# EAGLE design e1-xover (EAGLE 7.7.0)
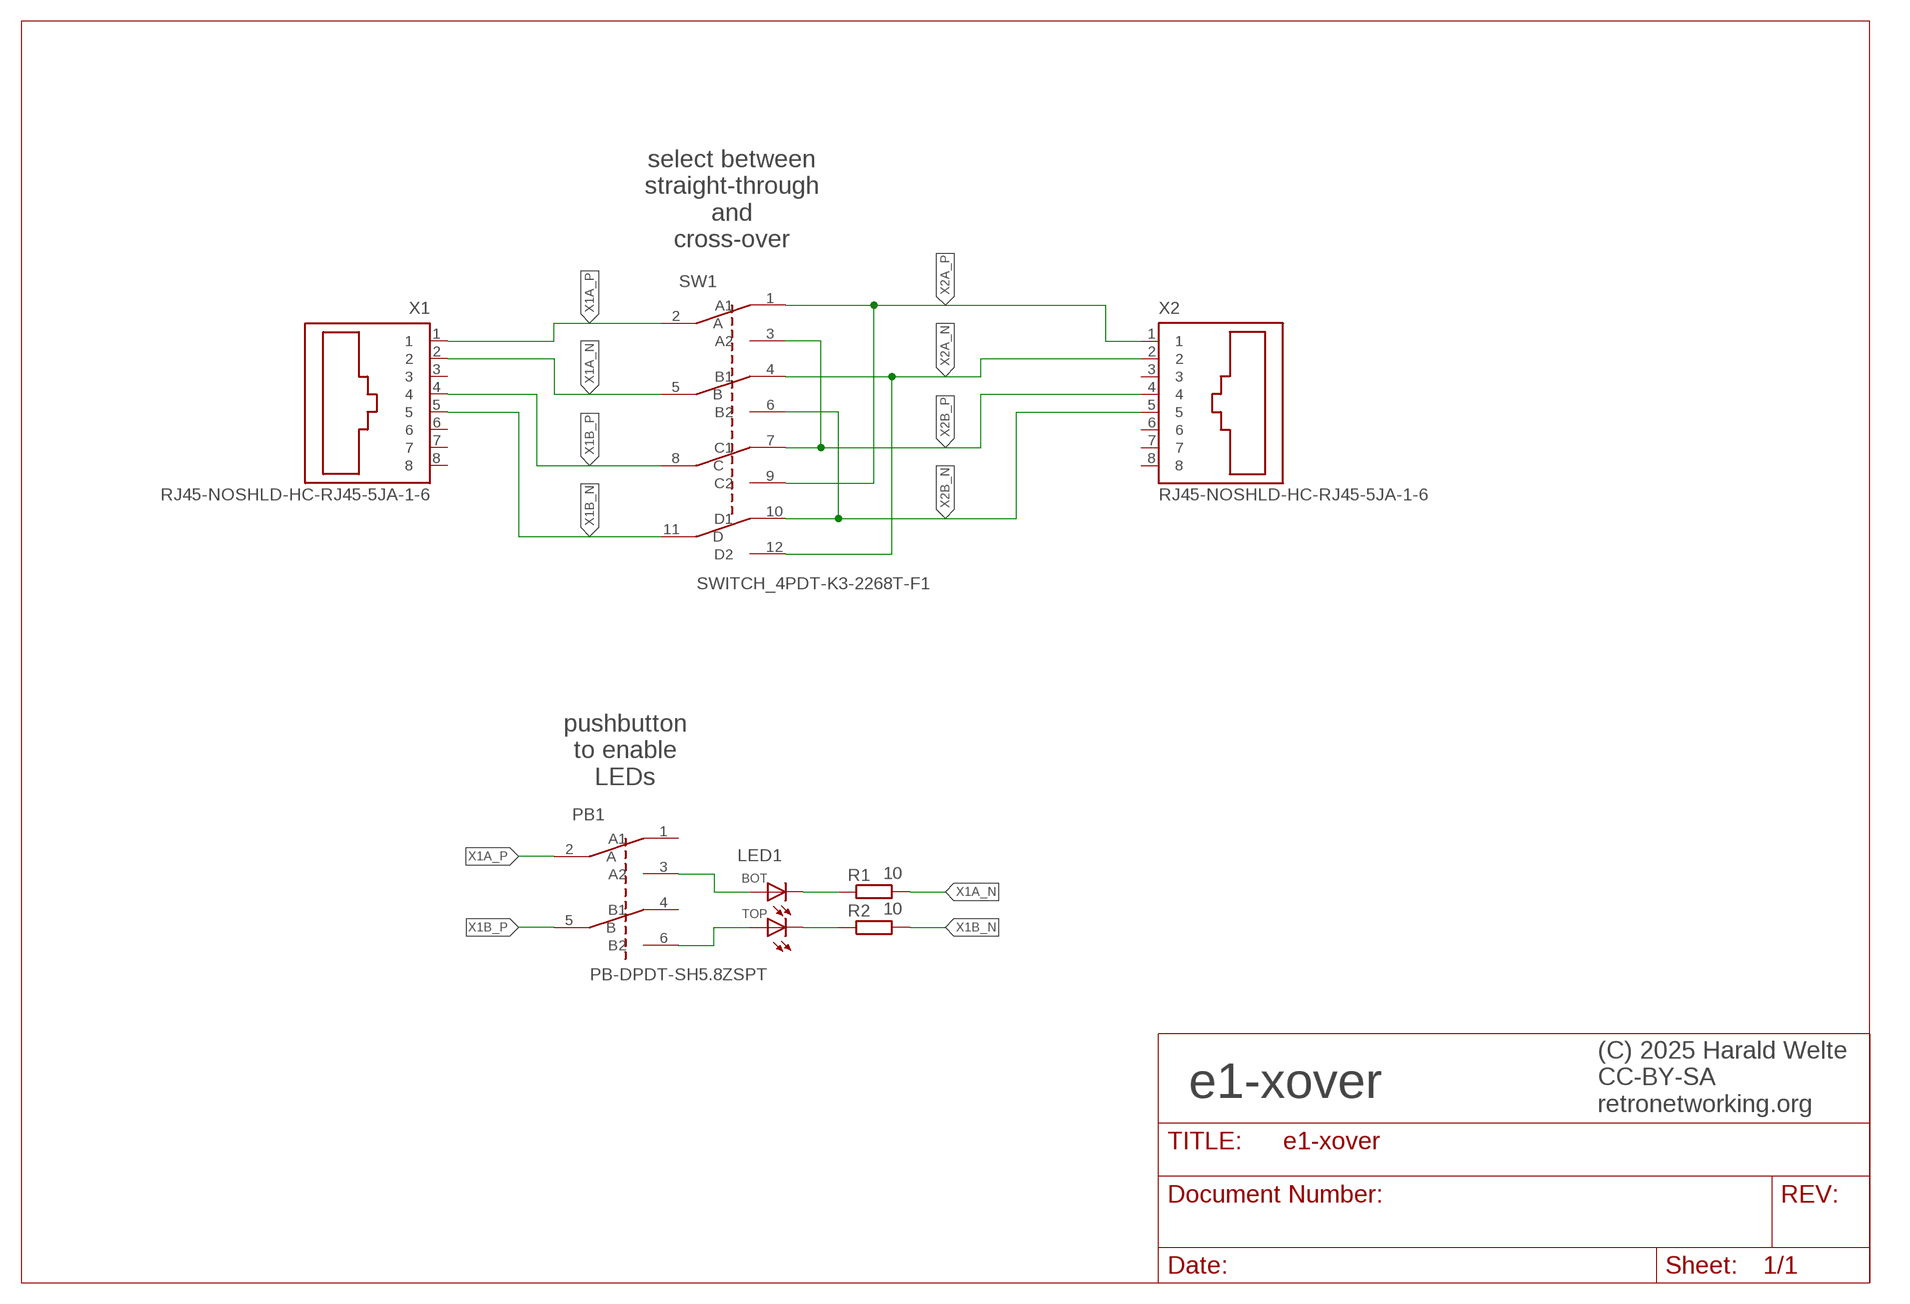
[diagram p0: schematic, sheet 1]

## Parts
LED1  DIALIGHT_2V-MHK2512RGTD  [MHK2512RGTD]
PB1  PB-DPDT-SH5.8ZSPT  [SH-5.8ZSPT]
R1  10  R-EU_0207/7  [0207/7]
R2  10  R-EU_0207/7  [0207/7]
SW1  SWITCH_4PDT-K3-2268T-F1  [K3--2268T-F1]
X1  RJ45-NOSHLD-HC-RJ45-5JA-1-6  [HC-RJ45-5JA-1-6]
X2  RJ45-NOSHLD-HC-RJ45-5JA-1-6  [HC-RJ45-5JA-1-6]

## Nets
N$3: LED1.BK(CB) R1.1
N$4: LED1.AK(CT) R2.1
N$9: LED1.BA(AB) PB1.3(A2)
N$10: LED1.AA(AT) PB1.6(B2)
X1A_N: R1.2 SW1.5(B) X1.2
X1A_P: PB1.2(A) SW1.2(A) X1.1
X1B_N: R2.2 SW1.11(D) X1.5
X1B_P: PB1.5(B) SW1.8(C) X1.4
X2A_N: SW1.4(B1) SW1.12(D2) X2.2
X2A_P: SW1.1(A1) SW1.9(C2) X2.1
X2B_N: SW1.6(B2) SW1.10(D1) X2.5
X2B_P: SW1.3(A2) SW1.7(C1) X2.4
Unconnected: PB1.1(A1) PB1.4(B1) X1.3 X1.6 X1.7 X1.8 X2.3 X2.6 X2.7 X2.8

## Notes on the sheet
- select between
  straight-through
  and
  cross-over
- pushbutton
  to enable
  LEDs
- e1-xover
- (C) 2025 Harald Welte
  CC-BY-SA
  retronetworking.org

## Library data of the parts
LED1 = led-dialight:DIALIGHT_2V: Dialight LED assembly, 2 leds, 3mm, vertical, through-hole, right-angle
PB1 = laforge:PB-DPDT: dual-pole dual-throw push-button
R1 R2 = resistor:R-EU_: RESISTOR, European symbol
SW1 = laforge:SWITCH_4PDT
X1 X2 = stewart-rj45:RJ45-NOSHLD

## Board
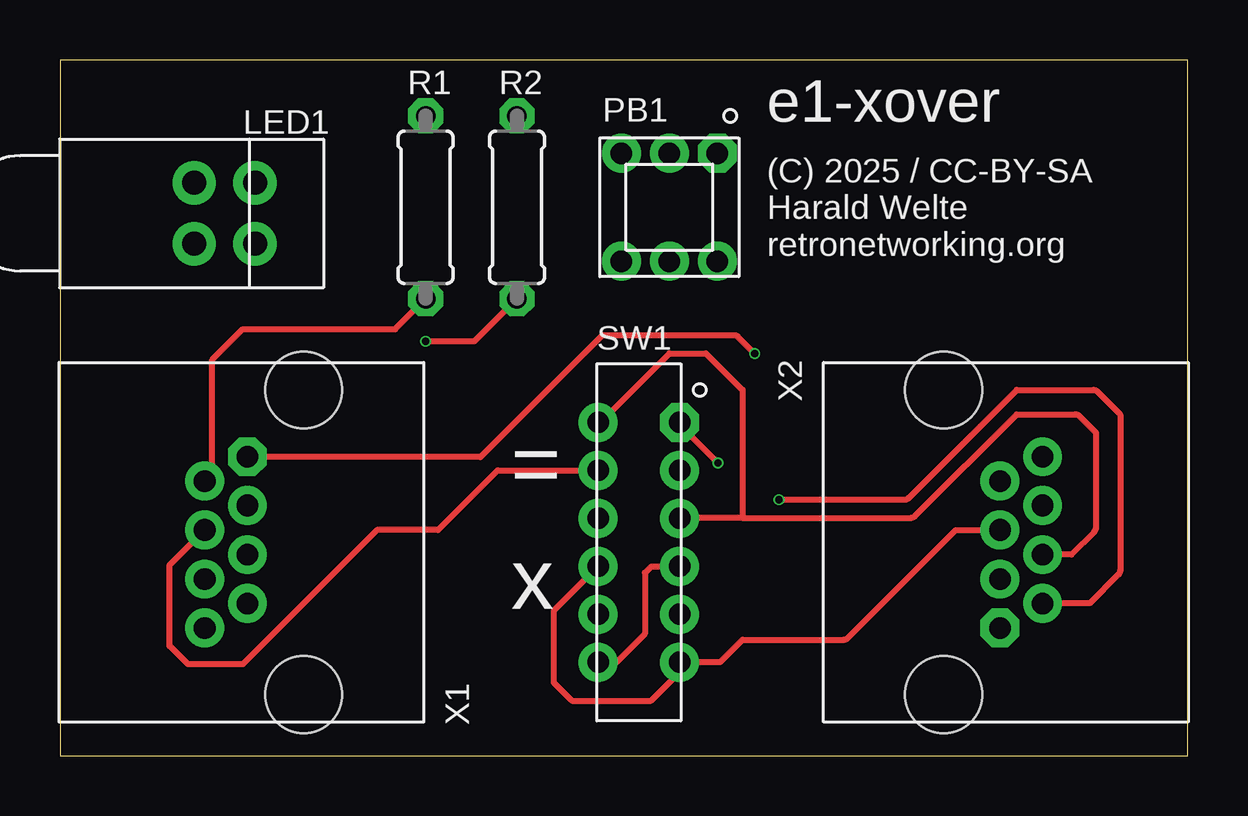
[diagram p1: board, top side]
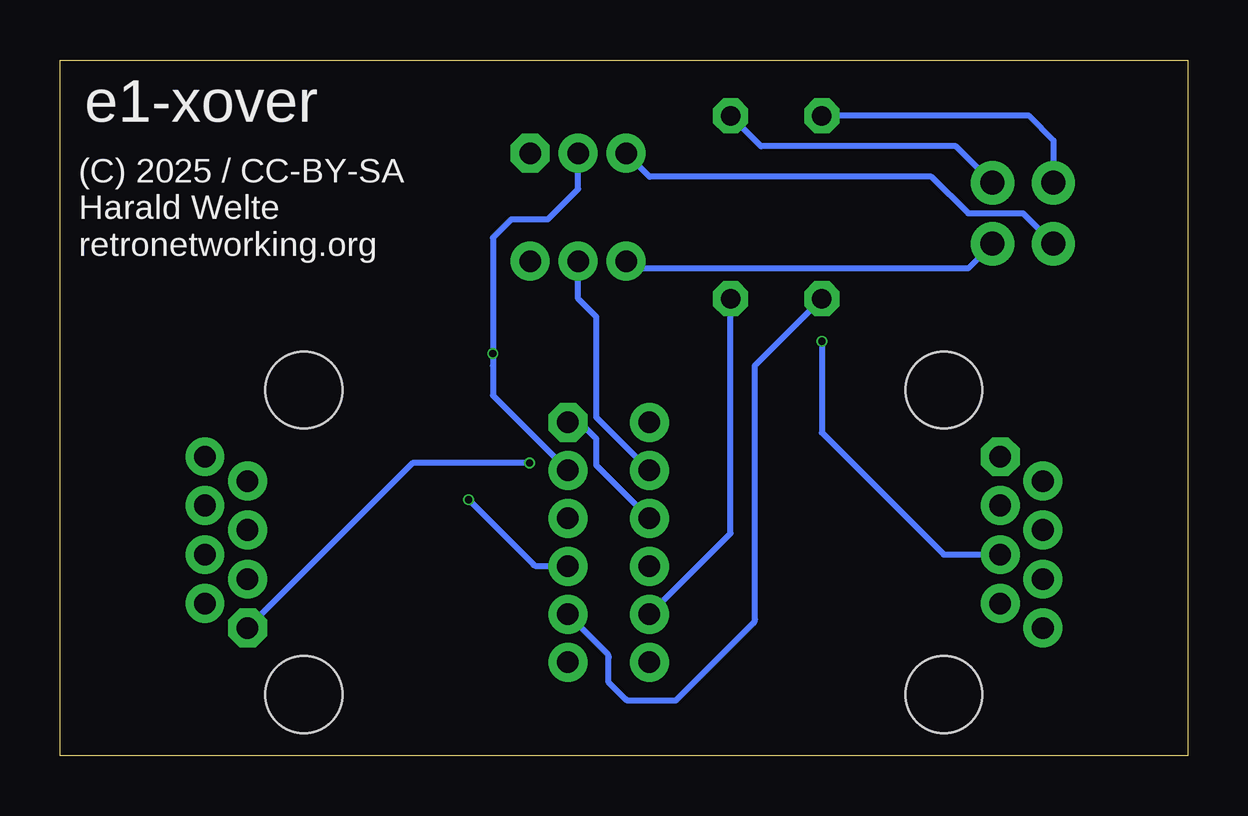
[diagram p2: board, bottom side, seen from below]

Size 47 x 29 mm. Coordinates in mm from the lower left corner, seen from the top.
Outline: 0,0 47,0 47,29 0,29 0,0
Copper layers (1*16): Top 0.035mm / dielectric 1.6mm / Bottom 0.035mm
Design rules "jlcpcb-2layers": minimum track width 5mil, minimum drill 0.3mm, track to track 5mil, track to pad 5mil, pad to pad 5mil, via to via 5mil, smd to smd 5mil, copper to edge 0.2mm, drill to drill 6mil, minimum pad ring 10mil, minimum via ring 3mil, stop-mask expansion 4mil, vias tented up to drill 0mil, thermal gap 10mil

### Footprints (pad centres in the part's own frame; a part is rotated, then mirrored left to right if it is on the bottom)
MHK2512RGTD = drill 1: AA 1.27,-1.27; AK 1.27,1.27; BA -1.27,-1.27; BK -1.27,1.27
SH-5.8ZSPT = drill 0.9 octagon: 1 -2,-2.25 | drill 0.9: 2 0,-2.25; 3 2,-2.25; 4 -2,2.25; 5 0,2.25; 6 2,2.25
0207/7 = drill 0.813 octagon: 1 -3.81,0; 2 3.81,0
K3--2268T-F1 = drill 0.9 octagon: 1 -5,1.7 | drill 0.9: 2 -3,1.7; 3 -1,1.7; 4 1,1.7; 5 3,1.7; 6 5,1.7; 7 -5,-1.7; 8 -3,-1.7; 9 -1,-1.7; 10 1,-1.7; 11 3,-1.7; 12 5,-1.7
HC-RJ45-5JA-1-6 = drill 0.9 pad 1.5 octagon: 1 3.57,2.35 | drill 0.9 pad 1.5: 2 2.55,4.13; 3 1.535,2.35; 4 0.515,4.13; 5 -0.515,2.35; 6 -1.535,4.13; 7 -2.55,2.35; 8 -3.57,4.13 | hole 3.2: -6.35,0; 6.35,0

### Placement (x,y rotation side)
LED1  6.86,22.61 0 top
PB1  25.4,22.86 180 top
R1  15.24,22.86 270 top
R2  19.05,22.86 270 top
SW1  24.13,8.89 270 top
X1  10.16,8.89 90 top
X2  36.83,8.89 270 top

### Tracks (layer width: path | path; a pad name or v marks a point on that pad's centre or on a via)
N$3
  Bottom 0.254: R1.1 6.6,26.67 5.59,25.65 LED1.BK
N$4
  Bottom 0.254: R2.1 17.78,25.4 9.65,25.4 LED1.AK
N$9
  Bottom 0.254: PB1.3 22.42,24.13 10.67,24.13 9.14,22.61 6.86,22.61 LED1.BA
N$10
  Bottom 0.254: PB1.6 23.11,20.32 9.14,20.32 LED1.AA
X1A_N
  Top 0.254: X1.2 6.35,11.76 6.35,16.51 7.62,17.78 13.97,17.78 R1.2
  Bottom 0.254: R1.2 18.03,16.26 18.03,5.69 arc45 18.11,5.51 21.34,2.29 23.26,2.29 arc45 23.44,2.36 24.13,3.05 24.13,4.08 arc-45 24.2,4.26 SW1.5
X1A_P  (via drill 0.3)
  Top 0.254: SW1.2 25.81,11.89 | X1.1 7.82,12.45 17.53,12.45 22.61,17.53 28.09,17.53 arc-45 28.27,17.45 v28.96,16.76
  Bottom 0.254: SW1.2 28.96,15.02 28.96,16.26 v28.96,16.76 28.96,21.59 28.19,22.35 26.67,22.35 25.4,23.62 PB1.2
X1B_N  (via drill 0.3)
  Top 0.254: v15.24,17.27 17.27,17.27 R2.2
  Bottom 0.254: SW1.11 19.05,9.27 R2.2 | v15.24,17.27 15.24,13.46 10.16,8.38 X1.5
X1B_P
  Top 0.254: SW1.8 18.24,11.89 15.76,9.4 13.21,9.4 7.62,3.81 5.33,3.81 4.57,4.57 4.57,7.95 X1.4
  Bottom 0.254: SW1.8 24.64,14.1 24.64,18.29 25.4,19.05 PB1.5
X2A_N  (via drill 0.3)
  Top 0.254: SW1.4 25.81,7.87 24.64,7.87 24.38,7.62 24.38,5.08 23.19,3.89 SW1.12 | v29.97,10.67 35.2,10.67 arc45 35.38,10.74 39.88,15.24 43.08,15.24 arc-45 43.25,15.17 44.2,14.22 44.2,7.72 arc-45 44.12,7.55 42.93,6.35 40.98,6.35 arc45 X2.2
  Bottom 0.254: SW1.4 27.09,7.89 arc45 27.27,7.96 v29.97,10.67
X2A_P  (via drill 0.3)
  Top 0.254: SW1.1 25.83,13.79 v27.43,12.19
  Bottom 0.254: SW1.9 24.64,12.1 24.64,13.21 25.32,13.89 SW1.1 | v27.43,12.19 32.31,12.19 X2.1
X2B_N
  Top 0.254: SW1.10 20.57,6.03 20.57,3.05 21.34,2.29 24.64,2.29 25.83,3.48 SW1.6 27.51,3.89 28.45,4.83 32.66,4.83 arc45 32.84,4.9 37.34,9.4 39.16,9.4 arc45 X2.5
X2B_P
  Top 0.254: 28.45,9.91 25.85,9.91 SW1.3 | SW1.7 22.53,13.89 25.4,16.76 26.92,16.76 28.45,15.24 28.45,9.91 | 28.45,9.91 35.45,9.91 arc45 35.63,9.98 39.88,14.22 42.31,14.22 arc-45 42.49,14.15 43.18,13.46 43.18,9.5 arc-45 43.11,9.32 42.16,8.38 40.98,8.38 arc45 X2.4

### Text on the board
tNames: e1-xover | (C) 2025 / CC-BY-SA / Harald Welte / retronetworking.org | = | x
bNames: e1-xover | (C) 2025 / CC-BY-SA / Harald Welte / retronetworking.org